# Altium project STM32F103RCT6_DEVELOPMENT_BOARD.PrjPcb
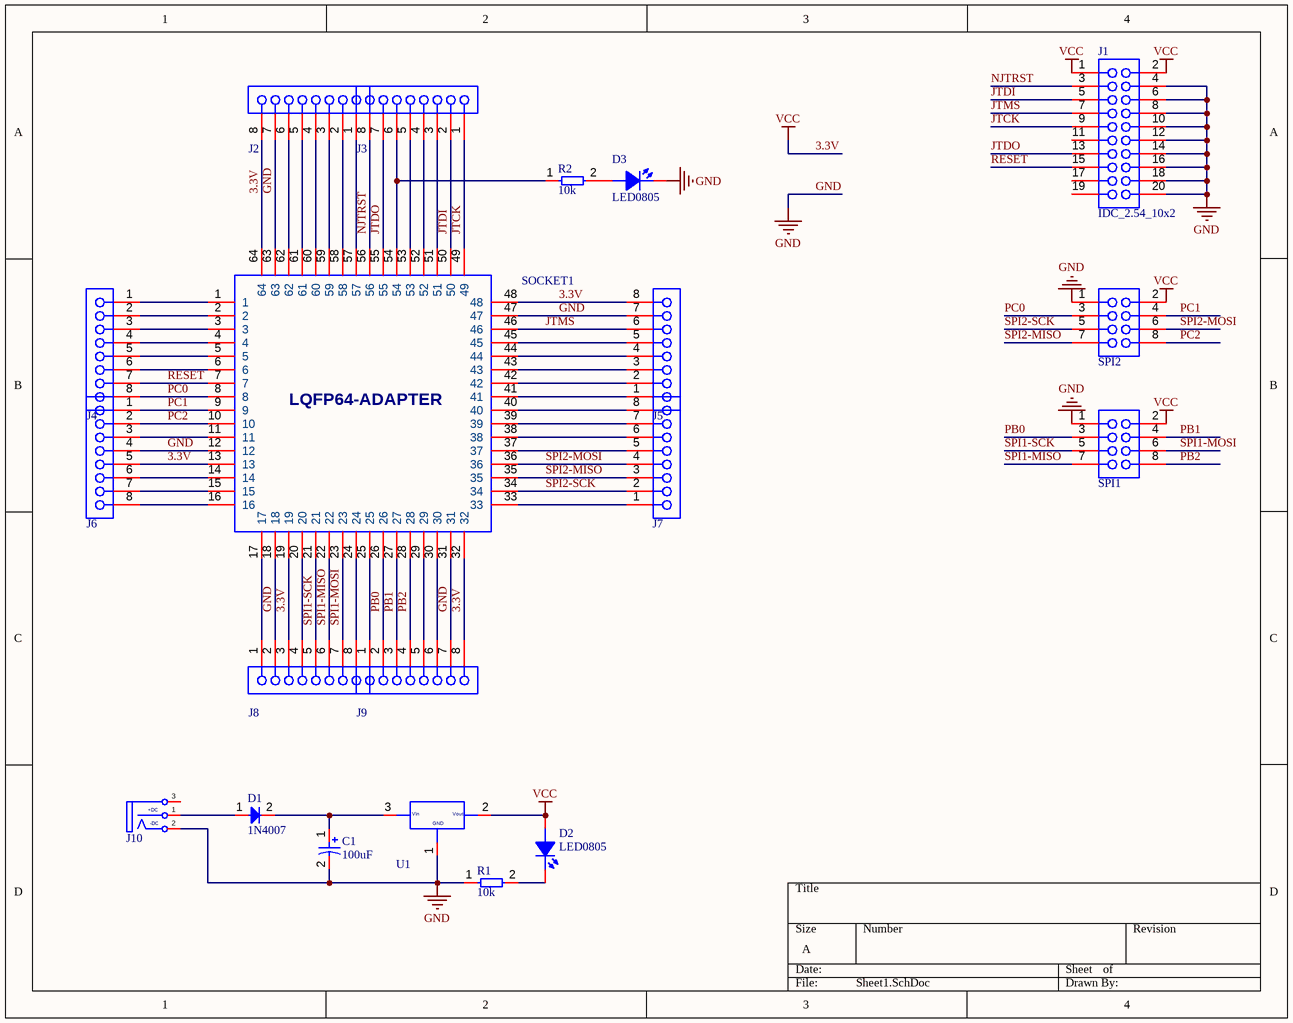
[diagram p0: Sheet1.SchDoc]
1 sheet, 20 parts. Net scope: global (net labels, ports and power ports of the same name join across sheets).
Board file: PCB1.PcbDoc

## Sheet Sheet1.SchDoc
size A

### Parts
C1  100uF  [CAP_RAD_7mm]
D1  1N4007  [DO-41]
D2  LED0805  [L0805RED]
D3  LED0805  [L0805RED]
J1  IDC_2.54_10x2  [IDC_CONNECTOR_20_2.54]
J2  Header 8x1 TH Pitch 2.54mm  [Header 8x1 TH Pitch 2.54mm]  (value not drawn)
J3  Header 8x1 TH Pitch 2.54mm  [Header 8x1 TH Pitch 2.54mm]  (value not drawn)
J4  Header 8x1 TH Pitch 2.54mm  [Header 8x1 TH Pitch 2.54mm]  (value not drawn)
J5  Header 8x1 TH Pitch 2.54mm  [Header 8x1 TH Pitch 2.54mm]  (value not drawn)
J6  Header 8x1 TH Pitch 2.54mm  [Header 8x1 TH Pitch 2.54mm]  (value not drawn)
J7  Header 8x1 TH Pitch 2.54mm  [Header 8x1 TH Pitch 2.54mm]  (value not drawn)
J8  Header 8x1 TH Pitch 2.54mm  [Header 8x1 TH Pitch 2.54mm]  (value not drawn)
J9  Header 8x1 TH Pitch 2.54mm  [Header 8x1 TH Pitch 2.54mm]  (value not drawn)
J10  Connector  [DC_K375A_Power]  (value not drawn)
R1  10k  [R0805]
R2  10k  [R0805]
SOCKET1  SOCKET-ADAPTER-OTQ-64-05-03  [SOCKET-ADAPTER-OTQ-64-05-03]  (value not drawn)
SPI1  Header 4x2 TH Pitch 2.54mm  [Header 4x2 TH Pitch 2.54mm]  (value not drawn)
SPI2  Header 4x2 TH Pitch 2.54mm  [Header 4x2 TH Pitch 2.54mm]  (value not drawn)
U1  AMS1117  [SOT223-3]  (value not drawn)

### Nets
3.3V: D2.1(A) J1.1 J1.2 J2.8 J5.8 J6.5 J8.3 J9.8 SOCKET1.13 SOCKET1.19 SOCKET1.32 SOCKET1.48 SOCKET1.64 SPI1.2 SPI2.2 U1.2  [also labelled VCC]
GND: C1.2 D3.2(K) J1.4 J1.6 J1.8 J1.10 J1.12 J1.14 J1.16 J1.18 J1.20 J2.7 J5.7 J6.4 J8.2 J9.7 J10.2(DC-) R1.1 SOCKET1.12 SOCKET1.18 SOCKET1.31 SOCKET1.47 SOCKET1.63 SPI1.1 SPI2.1 U1.1
JTCK: J1.9 J3.1 SOCKET1.49
JTDI: J1.5 J3.2 SOCKET1.50
JTDO: J1.13 J3.7 SOCKET1.55
JTMS: J1.7 J5.6 SOCKET1.46
NJTRST: J1.3 J3.8 SOCKET1.56
PB0: J9.2 SOCKET1.26 SPI1.3
PB1: J9.3 SOCKET1.27 SPI1.4
PB2: J9.4 SOCKET1.28 SPI1.8
PC0: J4.8 SOCKET1.8 SPI2.3
PC1: J6.1 SOCKET1.9 SPI2.4
PC2: J6.2 SOCKET1.10 SPI2.8
RESET: J1.15 J4.7 SOCKET1.7
SPI1-MISO: J8.6 SOCKET1.22 SPI1.7
SPI1-MOSI: J8.7 SOCKET1.23 SPI1.6
SPI1-SCK: J8.5 SOCKET1.21 SPI1.5
SPI2-MISO: J7.3 SOCKET1.35 SPI2.7
SPI2-MOSI: J7.4 SOCKET1.36 SPI2.6
SPI2-SCK: J7.2 SOCKET1.34 SPI2.5
NetC1_1: C1.1 D1.2 U1.3
NetD1_1: D1.1 J10.1(DS+)
NetD2_2: D2.2(K) R1.2
NetD3_1: D3.1(A) R2.2
NetJ2_1: J2.1 SOCKET1.57
NetJ2_2: J2.2 SOCKET1.58
NetJ2_3: J2.3 SOCKET1.59
NetJ2_4: J2.4 SOCKET1.60
NetJ2_5: J2.5 SOCKET1.61
NetJ2_6: J2.6 SOCKET1.62
NetJ3_3: J3.3 SOCKET1.51
NetJ3_4: J3.4 SOCKET1.52
NetJ3_5: J3.5 SOCKET1.53
NetJ3_6: J3.6 R2.1 SOCKET1.54
NetJ4_1: J4.1 SOCKET1.1
NetJ4_2: J4.2 SOCKET1.2
NetJ4_3: J4.3 SOCKET1.3
NetJ4_4: J4.4 SOCKET1.4
NetJ4_5: J4.5 SOCKET1.5
NetJ4_6: J4.6 SOCKET1.6
NetJ5_1: J5.1 SOCKET1.41
NetJ5_2: J5.2 SOCKET1.42
NetJ5_3: J5.3 SOCKET1.43
NetJ5_4: J5.4 SOCKET1.44
NetJ5_5: J5.5 SOCKET1.45
NetJ6_3: J6.3 SOCKET1.11
NetJ6_6: J6.6 SOCKET1.14
NetJ6_7: J6.7 SOCKET1.15
NetJ6_8: J6.8 SOCKET1.16
NetJ7_1: J7.1 SOCKET1.33
NetJ7_5: J7.5 SOCKET1.37
NetJ7_6: J7.6 SOCKET1.38
NetJ7_7: J7.7 SOCKET1.39
NetJ7_8: J7.8 SOCKET1.40
NetJ8_1: J8.1 SOCKET1.17
NetJ8_4: J8.4 SOCKET1.20
NetJ8_8: J8.8 SOCKET1.24
NetJ9_1: J9.1 SOCKET1.25
NetJ9_5: J9.5 SOCKET1.29
NetJ9_6: J9.6 SOCKET1.30

Not connected (* = marked no-connect by the designer): J1 11 17 19; J10 3(T)

### Notes on the sheet
- (in symbol AMS1117(SOT-223)) Vin; Vout; GND
- (in symbol JackDC) +DC; -DC
- (in symbol SOCKET-ADAPTER-OTQ-64-05-03) LQFP64-ADAPTER

### Library data of the parts
C1 = Capacitor(Radian)
J10 = JackDC
R1 R2 = Resistor SMD
U1 = AMS1117(SOT-223)